# Altium project Control_Devices.PrjPcb (part 3 of 3)
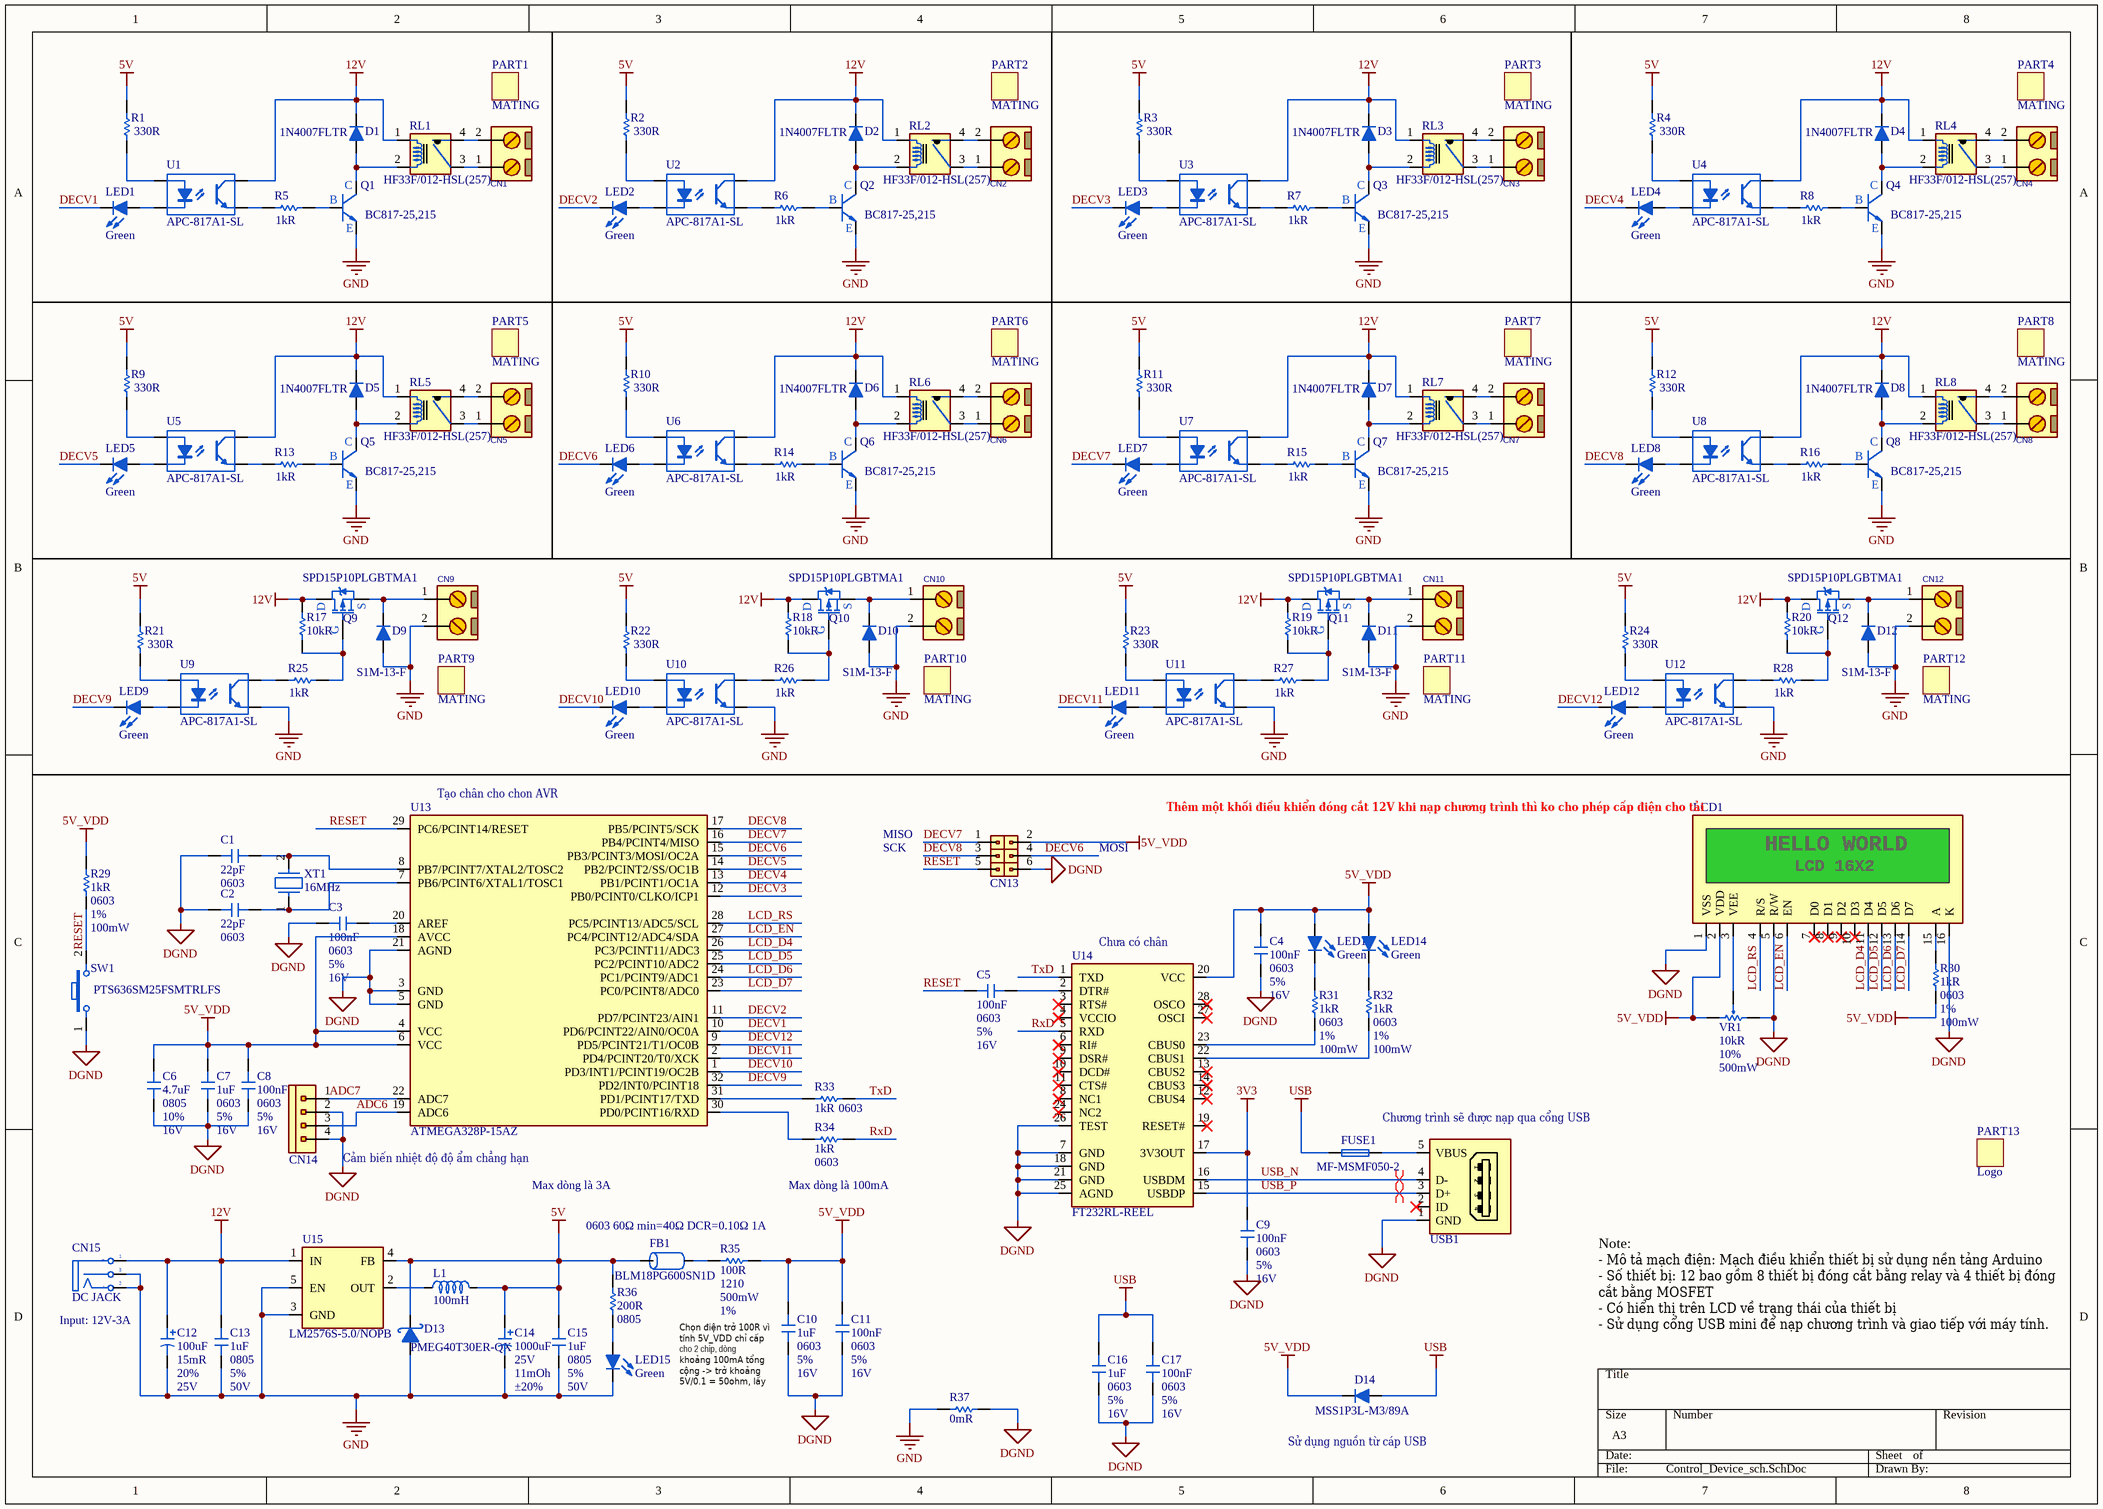
[diagram p2: Control_Device_sch.SchDoc]

## Sheet Control_Device_sch.SchDoc (continued)

### Library data of the parts (continued)
U13 = ATMEGA328: 8-bit AVR MCU, 32 KB, 2048 Bytes, 20 MHz, 1.8 to 5.5V, TQFP-32, RoHS; Manufacturer: Microchip; RAM Size: 2KB; Interface: I2C,SPI,UART,USART; Number of I/Os: 23; Frequency: 16MHz; Min Supply Voltage: 2.7V; Number of Timers/Counters: 3; Oscillator Type: Internal; Memory Type: FLASH; Memory Size: 32KB; Peripherals: Brown-out Detect/Reset,POR,PWM,WDT; Supplier 1: Newark; Supplier Part Number 1: 72T3141; Manufacturer Part Number: ATMEGA328P-15AZ; RoHS: Yes; Mount: Surface Mount; Case/Package: TQFP; Number of Pins: 32; Min Operating Temperature: -40°C; Max Operating Temperature: 125°C; Package Quantity: 1; Max Supply Voltage: 5.5V; Packaging: Cut Tape; Core Architecture: AVR; Series: AVR® ATmega; Radiation Hardening: No; Lead Free: Lead Free; RoHS Compliant: Yes; ComponentLink1URL: https://datasheet.ciiva.com/26860/getdatasheetpartid-742460-26860372.pdf?src-supplier=Verical; ComponentLink1Description: https://datasheet.ciiva.com/26860/getdatasheetpartid-742460-26860372.pdf?src-supplier=Verical; ComponentLink2URL: https://datasheet.ciiva.com/18625/atmel-7810-automotive-microcontrollers-atmega328p-datasheet-18625852.pdf?src-supplier=Digi-Key; ComponentLink2Description: https://datasheet.ciiva.com/18625/atmel-7810-automotive-microcontrollers-atmega328p-datasheet-18625852.pdf?src-supplier=Digi-Key
U14 = FT232RL: IC USB FS SERIAL UART 28-SSOP; Manufacturer: FTDI; Interface: UART,RS-232,RS-422,RS-485; Number of Channels: 1; Data Rate: 12Mbps; Operating Supply Current: 15mA; Max Supply Voltage: 5.25V; Min Supply Voltage: 3.3V; Voltage: 5V; Supplier 1: Digi-Key; Supplier Part Number 1: 768-1007-1-ND; Manufacturer Part Number: FT232RL-REEL; RoHS: Yes; Category: Interface ICs; Pricing 1: 1=4.8, 10=4.35, 50=4.15, 100=3.95, 250=3.55, 500=3.15, 1000=2.95 (USD); Mount: Surface Mount; Case/Package: SSOP; Number of Pins: 28; Weight: 0.080001oz; Min Operating Temperature: -40°C; Max Operating Temperature: 85°C; Packaging: Tape and Reel; Series: USBmadeEZ-UART; Package Quantity: 1; Number of Transceivers: 1; Length: 10.2mm; Width: 5.3mm; Height: 1.75mm; Radiation Hardening: No; Lead Free: Lead Free; Reach SVHC Compliant: No; RoHS Compliant: Yes; ComponentLink1URL: https://datasheet.ciiva.com/34304/2161019-34304054.pdf?src-supplier=Jameco; ComponentLink1Description: https://datasheet.ciiva.com/34304/2161019-34304054.pdf?src-supplier=Jameco; ComponentLink2URL: https://datasheet.ciiva.com/4787/ds-ft232r-11534-4787658.pdf?src-supplier=Mouser; ComponentLink2Description: https://datasheet.ciiva.com/4787/ds-ft232r-11534-4787658.pdf?src-supplier=Mouser; ComponentLink3URL: https://datasheet.ciiva.com/1787/ds-ft232r-1787048.pdf?src-supplier=Digi-Key; ComponentLink3Description: https://datasheet.ciiva.com/1787/ds-ft232r-1787048.pdf?src-supplier=Digi-Key; ComponentLink4URL: https://datasheet.ciiva.com/1787/ds-ft232r-1787047.pdf?src-supplier=Digi-Key; ComponentLink4Description: https://datasheet.ciiva.com/1787/ds-ft232r-1787047.pdf?src-supplier=Digi-Key; ComponentLink5URL: https://datasheet.ciiva.com/1787/ds-ft232r-1787049.pdf?src-supplier=Digi-Key; ComponentLink5Description: https://datasheet.ciiva.com/1787/ds-ft232r-1787049.pdf?src-supplier=Digi-Key; ComponentLink6URL: https://datasheet.ciiva.com/16200/ds-ft232r-16200652.pdf?src-supplier=Future+Electronics; ComponentLink6Description: https://datasheet.ciiva.com/16200/ds-ft232r-16200652.pdf?src-supplier=Future+Electronics; ComponentLink7URL: https://datasheet.ciiva.com/15150/getdatasheetpartid-643207-15150506.pdf?src-supplier=Verical; ComponentLink7Description: https://datasheet.ciiva.com/15150/getdatasheetpartid-643207-15150506.pdf?src-supplier=Verical
U15 = LM257X: SIMPLE SWITCHER® 40V, 3A Low Component Count Step-Down Regulator 5-DDPAK/TO-263 -40 to 125; Manufacturer: TI National Semiconductor; Min Supply Voltage: 4V; Number of Outputs: 1; Output Voltage: 5V; Frequency: 52kHz; Switching Frequency: 58kHz; Efficiency: 77%; Quiescent Current: 5mA; Output Type: Fixed; Creator: hoangpt; Publish: 25-Oct-2021; Supplier 1: Digi-Key; Supplier Part Number 1: LM2576S-5.0/NOPB-ND; Manufacturer Part Number: LM2576S-5.0/NOPB; RoHS: Yes; Category: Voltage Regulators - Switching; Stock 1: 3183; Pricing 1: 1=4.66, 10=4.185, 25=3.956, 100=3.4285, 250=3.25268, 500=2.91862, 1000=2.46149, 2500=2.33842 (USD); Mount: Surface Mount; Case/Package: TO-263; Number of Pins: 5; Min Operating Temperature: -40°C; Max Operating Temperature: 125°C; Max Supply Voltage: 40V; Max Output Current: 3A; Packaging: Rail/Tube; Min Input Voltage: 4V; Max Input Voltage: 40V; Output Current: 3A; Package Quantity: 45; Nominal Output Voltage: 5V; Max Output Voltage: 5V; Termination: SMD/SMT; Series: LM2576; Length: 10.16mm; Width: 8.64mm; Height: 4.57mm; Radiation Hardening: No; Reach SVHC Compliant: No; Lead Free: Contains Lead; RoHS Compliant: Yes; ComponentLink1URL: https://datasheet.ciiva.com/27050/894690-27050690.pdf?src-supplier=Jameco; ComponentLink1Description: https://datasheet.ciiva.com/27050/894690-27050690.pdf?src-supplier=Jameco; ComponentLink2URL: https://datasheet.ciiva.com/15112/getdatasheetpartid-89880-15112831.pdf?src-supplier=Verical; ComponentLink2Description: https://datasheet.ciiva.com/15112/getdatasheetpartid-89880-15112831.pdf?src-supplier=Verical; ComponentLink3URL: https://datasheet.ciiva.com/7994/1849802-7994190.pdf?src-supplier=Element14; ComponentLink3Description: https://datasheet.ciiva.com/7994/1849802-7994190.pdf?src-supplier=Element14; ComponentLink4URL: https://datasheet.ciiva.com/6596/lm2576hv-6596629.pdf?src-supplier=Digi-Key; ComponentLink4Description: https://datasheet.ciiva.com/6596/lm2576hv-6596629.pdf?src-supplier=Digi-Key
USB1 = CONN_USB_MICRO_B: CONN RCPT MICRO USB R/A SMD; Manufacturer: Molex; Manufacturer Part Number: 1050170001; MANF_P#: 10103593-0001LF; MANF: FCI; Gender: Receptacle; Current Rating: 1.8A; Number of Ports: 1; Number of Contacts: 5; Max Voltage Rating (AC): 30V; USB Standard: USB 2.0; Pitch: 0.65mm; VALUE: CONN_USB_MICROB; Supplier 1: Mouser; Supplier Part Number 1: 538-105017-0001; RoHS: Yes; Category: USB Connectors; Stock 1: 118545; Pricing 1: 1=0.95, 10=0.808, 50=0.808, 100=0.684, 500=0.675, 1000=0.56, 2000=0.505, 4000=0.495, 10000=0.495, 24000=0.472 (USD); Mount: Surface Mount; Contact Plating: Gold; Contact Material: Copper Alloy,Copper; Housing Material: Polymer; Min Operating Temperature: -30°C; Max Operating Temperature: 85°C; Packaging: Tape and Reel; Connector Type: USB; Termination: Solder; Voltage Rating: 30V; Number of Positions: 5; Orientation: Right Angle; Number of Circuits: 5; Series: 105017; Length: 8.2mm; Depth: 7.5mm; RoHS Compliant: Yes; Halogen Free: Low Halogen; Reach SVHC Compliant: Unknown; ComponentLink1URL: https://datasheet.ciiva.com/3094/1050170001-io-connectors-3094416.pdf?src-supplier=Avnet; ComponentLink1Description: https://datasheet.ciiva.com/3094/1050170001-io-connectors-3094416.pdf?src-supplier=Avnet; ComponentLink2URL: https://datasheet.ciiva.com/4598/1050170001-io-connectors-152207-4598759.pdf?src-supplier=Mouser; ComponentLink2Description: https://datasheet.ciiva.com/4598/1050170001-io-connectors-152207-4598759.pdf?src-supplier=Mouser; ComponentLink3URL: https://datasheet.ciiva.com/851/1050170001-sd-851276.pdf?src-supplier=Digi-Key; ComponentLink3Description: https://datasheet.ciiva.com/851/1050170001-sd-851276.pdf?src-supplier=Digi-Key; ComponentLink4URL: https://datasheet.ciiva.com/851/1050170001-sd-851277.pdf?src-supplier=Digi-Key; ComponentLink4Description: https://datasheet.ciiva.com/851/1050170001-sd-851277.pdf?src-supplier=Digi-Key; ComponentLink5URL: https://datasheet.ciiva.com/851/1050170001-sd-851278.pdf?src-supplier=Digi-Key; ComponentLink5Description: https://datasheet.ciiva.com/851/1050170001-sd-851278.pdf?src-supplier=Digi-Key; ComponentLink6URL: https://datasheet.ciiva.com/16668/1050170001-io-connectors-16668598.pdf?; ComponentLink6Description: https://datasheet.ciiva.com/16668/1050170001-io-connectors-16668598.pdf?
VR1 = POT-SINGLE: Trimmer, Cermet, Rest 10 Kilohms, PCB, 1 Turns, Pwr-Rtg 0.5 W, Tol 10%; Manufacturer: Bourns; Manufacturer Part Number: 3362P-1-103LF; Number of Turns: 1; Voltage Rating: 300V; Temperature Coefficient: 100ppm/°C; Insulation Resistance: 1GR; Creator: hoangpt; Publish: 25-Oct-2021; Supplier 1: Arrow Electronics; Supplier Part Number 1: 3362P-1-103LF; RoHS: Yes; Category: Variable Resistors and Potentiometers; Stock 1: 5341; Pricing 1: 1=0.9698, 10=0.8921, 25=0.8129, 50=0.7837, 100=0.7252, 250=0.6749, 500=0.5701, 1000=0.5424, 5000=0.4264 (USD); Mount: Through Hole,PCB; Number of Pins: 3; Weight: 0.02oz; Color: Blue; Min Operating Temperature: -55°C; Max Operating Temperature: 125°C; Resistance: 10kR; Resistor Type: Cermet; Packaging: Rail/Tube; Termination: Pin; Series: Trimpot® 3362 - Sealed; Resistance Tolerance: 10%; Taper: Linear; Max Power Dissipation: 500mW; Technology: CERMET; Type: Potentiometer; Length: 6.6mm; Width: 6.6mm; Height: 4.7mm; Depth: 6.99mm; Radiation Hardening: No; Reach SVHC Compliant: No; Lead Free: Lead Free; Military Standard: Not; RoHS Compliant: Yes; ComponentLink1URL: https://datasheet.ciiva.com/19481/1158096-19481852.pdf?src-supplier=Jameco; ComponentLink1Description: https://datasheet.ciiva.com/19481/1158096-19481852.pdf?src-supplier=Jameco; ComponentLink2URL: https://datasheet.ciiva.com/11832/0900766b8069ccf8-11832268.pdf?src-supplier=Rs; ComponentLink2Description: https://datasheet.ciiva.com/11832/0900766b8069ccf8-11832268.pdf?src-supplier=Rs; ComponentLink3URL: https://datasheet.ciiva.com/29122/447330-da-01-en-trimmer-tht-3362p-1-103lf-10k-0-5w-29122261.pdf?src-supplier=Conrad; ComponentLink3Description: https://datasheet.ciiva.com/29122/447330-da-01-en-trimmer-tht-3362p-1-103lf-10k-0-5w-29122261.pdf?src-supplier=Conrad; ComponentLink4URL: https://datasheet.ciiva.com/14108/mk3362-dat-e-14108843.pdf?src-supplier=Distrelec; ComponentLink4Description: https://datasheet.ciiva.com/14108/mk3362-dat-e-14108843.pdf?src-supplier=Distrelec; ComponentLink5URL: https://datasheet.ciiva.com/3266/3362-3266299.pdf?src-supplier=Avnet; ComponentLink5Description: https://datasheet.ciiva.com/3266/3362-3266299.pdf?src-supplier=Avnet; ComponentLink6URL: https://datasheet.ciiva.com/2156/3362-2156381.pdf?src-supplier=Digi-Key; ComponentLink6Description: https://datasheet.ciiva.com/2156/3362-2156381.pdf?src-supplier=Digi-Key; ComponentLink7URL: https://datasheet.ciiva.com/30248/3362-30248694.pdf?src-supplier=Onlinecomponents.com; ComponentLink7Description: https://datasheet.ciiva.com/30248/3362-30248694.pdf?src-supplier=Onlinecomponents.com; ComponentLink8URL: https://datasheet.ciiva.com/18411/70153603-18411579.pdf?src-supplier=Allied+Electronics; ComponentLink8Description: https://datasheet.ciiva.com/18411/70153603-18411579.pdf?src-supplier=Allied+Electronics
XT1 = XTAL: Crystal 16.0000MHZ 22PF Th; Manufacturer: IQD; Manufacturer Part Number: LFXTAL027945BULK; Creator: hoangpt; Publish: 25-Oct-2021; Supplier 1: Digi-Key; Supplier Part Number 1: 1923-1788-ND; RoHS: Yes; Stock 1: 2895; Pricing 1: 1=0.5, 10=0.419, 50=0.3772, 100=0.3353, 500=0.31856, 1000=0.26826, 2500=0.25149, 5000=0.24311, 10000=0.23472 (USD); Value: 16MHz